# EAGLE design tinyPipes (EAGLE 6.5.0)
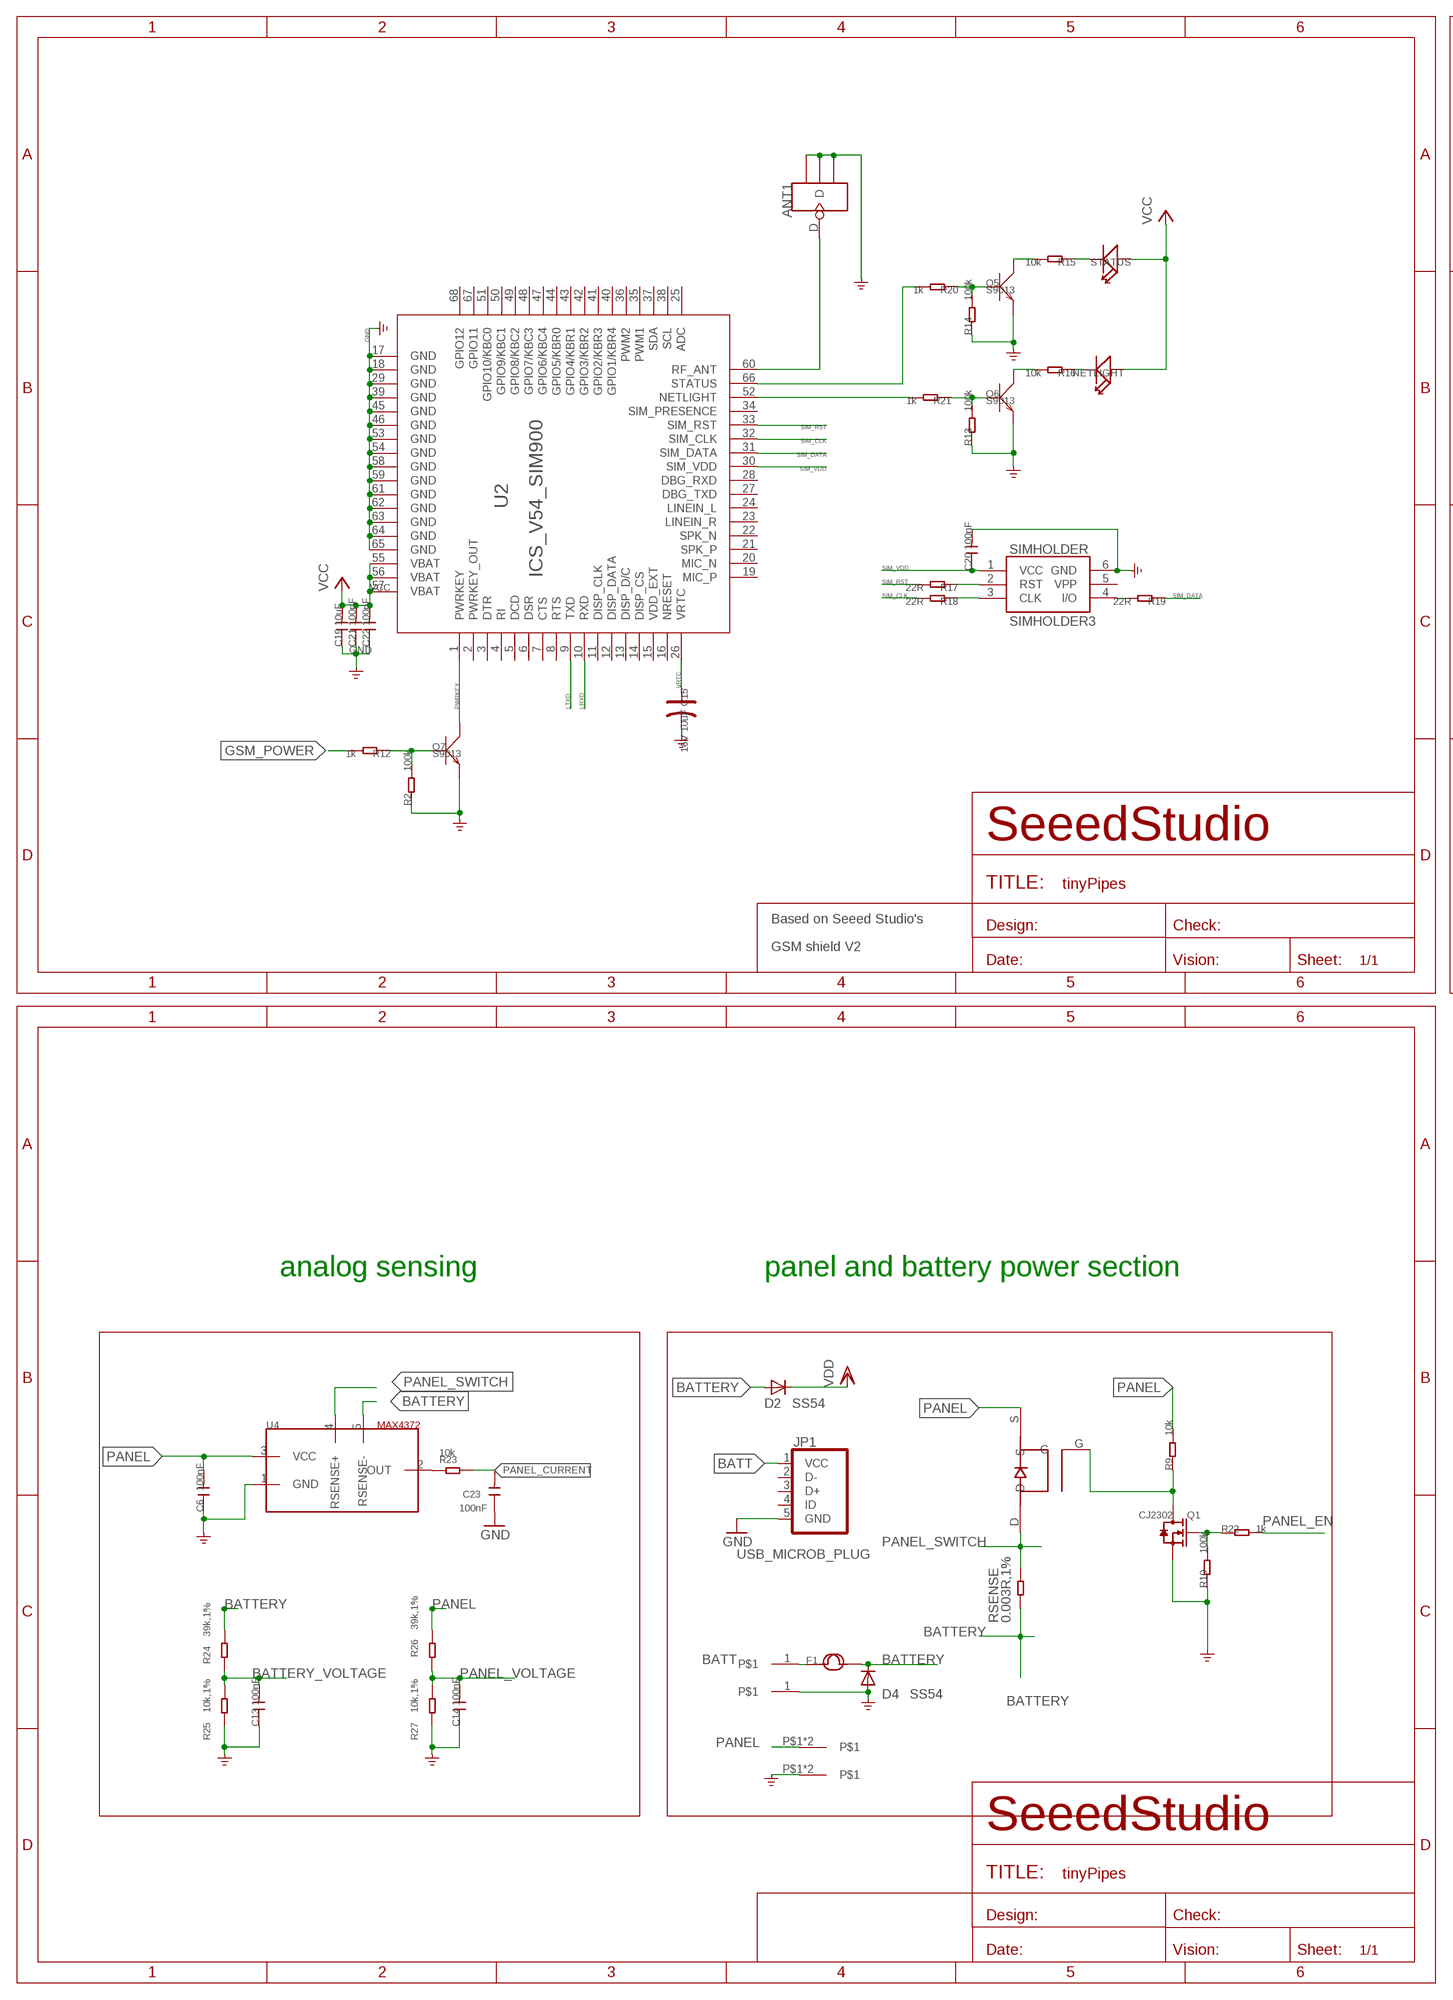
[diagram p0: schematic, sheet 1, part 1 of 2]
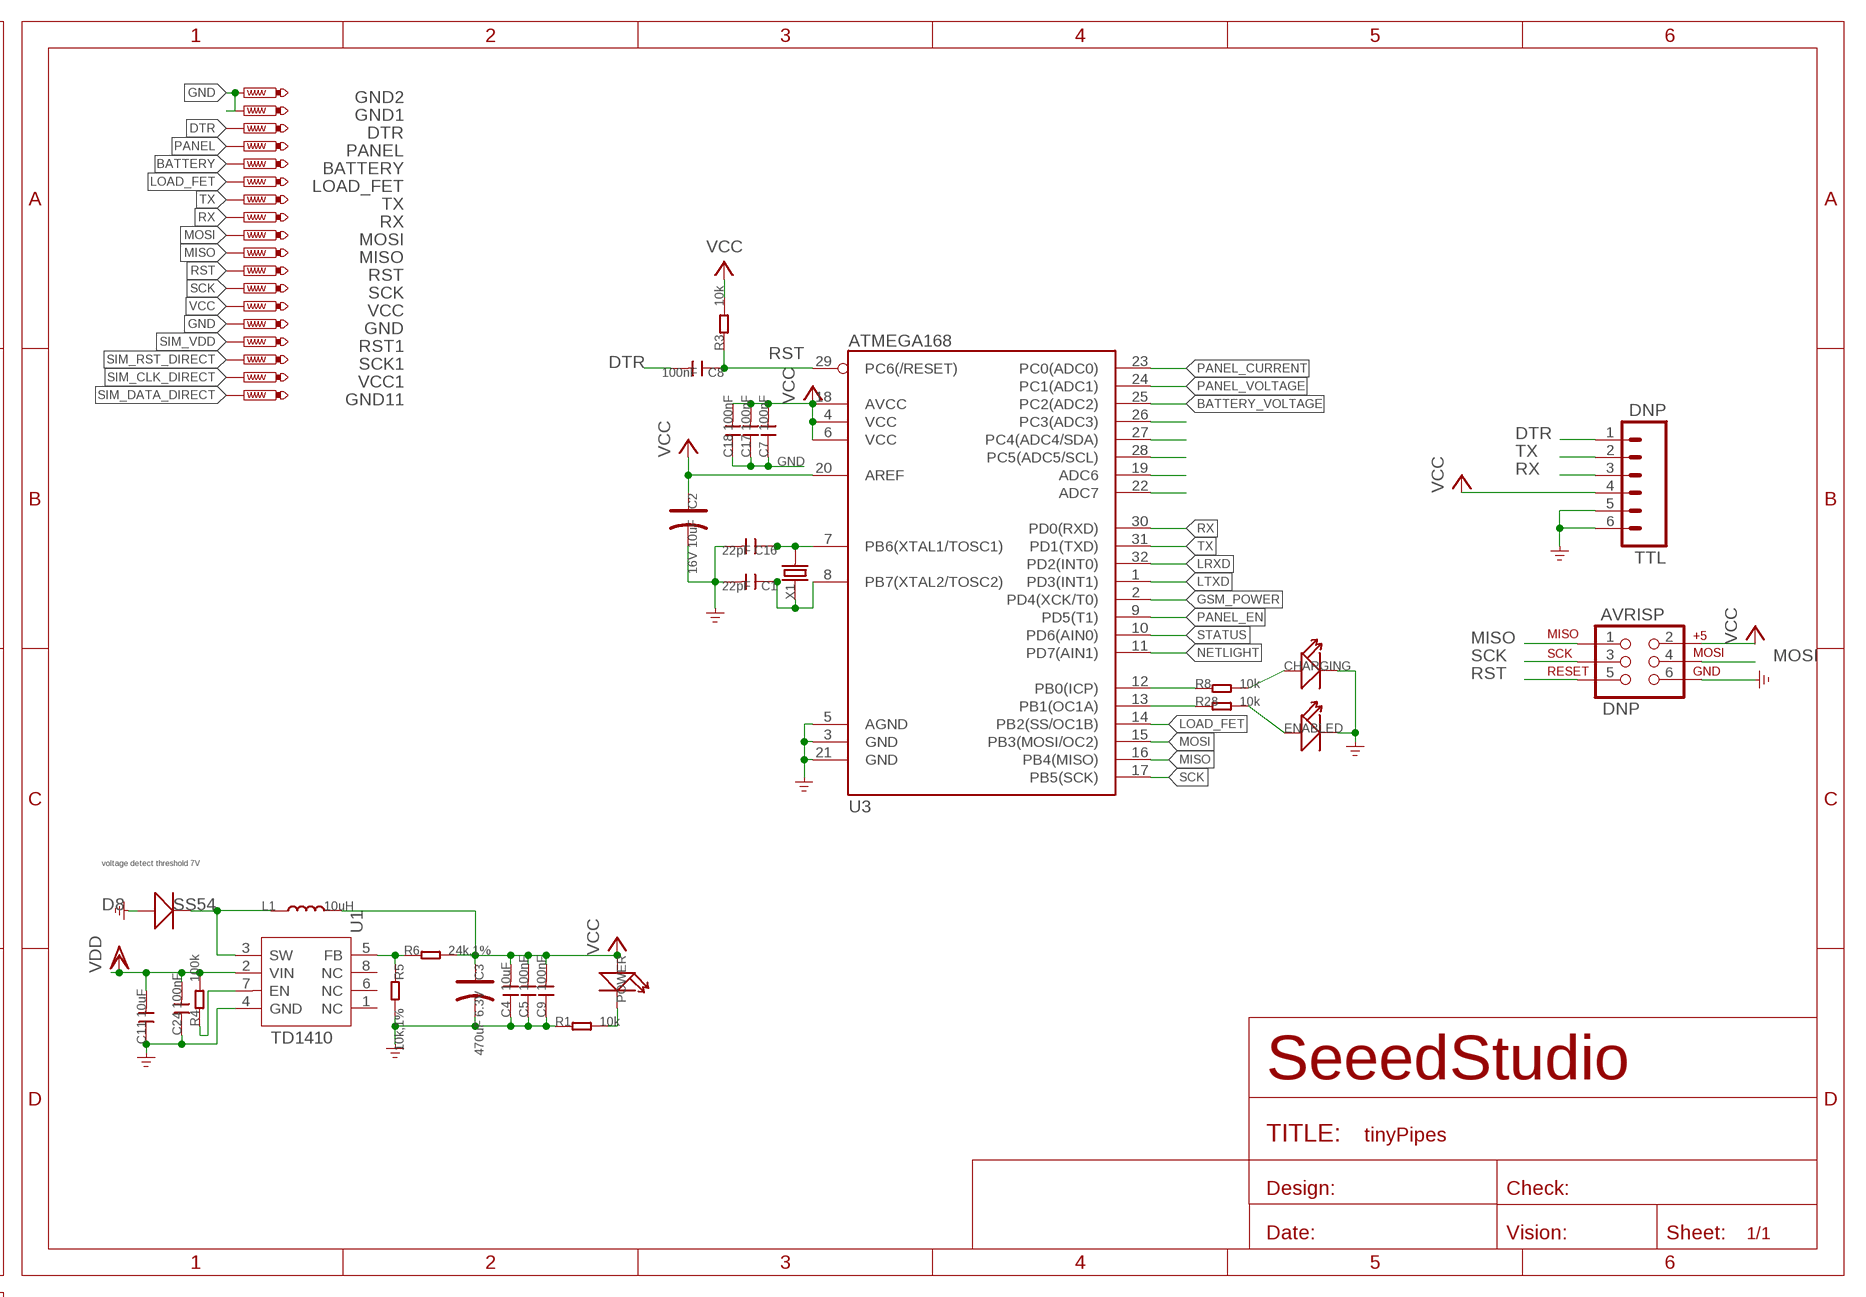
[diagram p1: schematic, sheet 1, part 2 of 2]

## Parts
ANT1  ANTENNA-U-FL  [4P-U-FL]
AVRISP  DNP  AVR_SPI_PRG_62X3_LOCK  [2X3_LOCK]
BATTERY  HEARTPAD  [HEART]
BATTERY+  TINYPIPES_BATTBATT  [TINYPIPES_BATT]
BATTERY-  TINYPIPES_BATTBATT  [TINYPIPES_BATT]
C1  22pF  C-0603  [C0603]
C2  16V 10uF  CAP-AVX-A  [AVX-A]
C3  470uF 6.3V  CAP-AVX-D  [AVX-D]
C4  10uF  C-0805  [C0805]
C5  100nF  C-0603  [C0603]
C6  100nF  C-0603  [C0603]
C7  100nF  C-0603  [C0603]
C8  100nF  C-0603  [C0603]
C9  100nF  C-0603  [C0603]
C11  10uF  C-0805  [C0805]
C13  100nF  C-0603  [C0603]
C14  100nF  C-0603  [C0603]
C15  16V 10uF  CAP-AVX-A  [AVX-A]
C16  22pF  C-0603  [C0603]
C17  100nF  C-0603  [C0603]
C18  100nF  C-0603  [C0603]
C19  10uF  C-0805  [C0805]
C20  100nF  C-0603  [C0603]
C21  100nF  C-0603  [C0603]
C22  100nF  C-0603  [C0603]
C23  100nF  C-0805  [C0805]
C24  100nF  C-0603  [C0603]
CHARGING  LED'0603'  [LED-0603]
D2  SS54  DIODE-SMB  [SMB]
D4  SS54  DIODE-SMB  [SMB]
D8  SS54  D'MBRS240LT3'  [SMB]
DTR  HEARTPAD  [HEART]
ENABLED  LED'0603'  [LED-0603]
F1  FUSE'16R700'  [0210]
GND  HEARTPAD  [HEART]
GND1  HEARTPAD  [HEART]
GND2  HEARTPAD  [HEART]
GND11  HEARTPAD  [HEART]
JP1  USB_MICROB_PLUG  [MICRO-B-RA-SMT]
L1  10uH  L'0630'  [L0630]
LOAD_FET  HEARTPAD  [HEART]
MISO  HEARTPAD  [HEART]
MOSI  HEARTPAD  [HEART]
NETLIGHT  LED'0603'  [LED-0603]
PANEL  HEARTPAD  [HEART]
PANEL+  TINYPIPES_BATTPANEL  [TINYPIPES_PANEL]
PANEL-  TINYPIPES_BATTPANEL  [TINYPIPES_PANEL]
POWER  LED'0603'  [LED-0603]
Q1  CJ2302  MOSFET-N'SOT23'  [SOT23]
Q5  S9013  TRANSISTOR-NPN-SOT23  [SOT23]
Q6  S9013  TRANSISTOR-NPN-SOT23  [SOT23]
Q7  S9013  TRANSISTOR-NPN-SOT23  [SOT23]
R1  10k  R-0603  [R0603]
R2  100k  R-0603  [R0603]
R3  10k  R-0603  [R0603]
R4  100k  R-0603  [R0603]
R5  10k,1%  R-0603  [R0603]
R6  24k,1%  R-0603  [R0603]
R8  10k  R-0603  [R0603]
R9  10k  R-0603  [R0603]
R10  100k  R-0603  [R0603]
R12  1k  R-0603  [R0603]
R13  100k  R-0603  [R0603]
R14  100k  R-0603  [R0603]
R15  10k  R-0603  [R0603]
R16  10k  R-0603  [R0603]
R17  22R  R-0603  [R0603]
R18  22R  R-0603  [R0603]
R19  22R  R-0603  [R0603]
R20  1k  R-0603  [R0603]
R21  1k  R-0603  [R0603]
R22  1k  R-0603  [R0603]
R23  10k  R-0603  [R0603]
R24  39k,1%  R-0603  [R0603]
R25  10k,1%  R-0603  [R0603]
R26  39k,1%  R-0603  [R0603]
R27  10k,1%  R-0603  [R0603]
R28  10k  R-0603  [R0603]
RSENSE  0.003R,1%  R-2512  [R2512]
RST  HEARTPAD  [HEART]
RST1  HEARTPAD  [HEART]
RX  HEARTPAD  [HEART]
SCK  HEARTPAD  [HEART]
SCK1  HEARTPAD  [HEART]
SIMHOLDER  SIMHOLDER3  [SIMHOLDER3]
STATUS  LED'0603'  [LED-0603]
TTL  DNP  M06LOCK  [1X06_LOCK]
TX  HEARTPAD  [HEART]
U1  TD1410  [SOP8]
U2  ICS_V54_SIM900  [ICS_V54_SIM900]
U3  ATMEGA168  [TQFP32-08]
U4  MAX4372  [SOT23-5]
U5  SI4435POWER  [SO8_FET]
VCC  HEARTPAD  [HEART]
VCC1  HEARTPAD  [HEART]
X1  CRYSTAL'5032'  [2P-SMD-5X3.2]

## Nets
`: U3.19(ADC6)
ALT: U3.26(PC3(ADC3))
ALT2: U3.27(PC4(ADC4/SDA))
ALT3: U3.28(PC5(ADC5/SCL))
ALT5: U3.22(ADC7)
BATT [power]: BATTERY+.1 F1.1 JP1.1(VCC)
BATTERY [power]: BATTERY.P$1(TP) D2.A D4.C F1.2 R24.2 RSENSE.1 U4.5(RSENSE-)
BATTERY_VOLTAGE: C13.2 R24.1 R25.2 U3.25(PC2(ADC2))
DTR: C8.2 DTR.P$1(TP) TTL.1
GND: ANT1.GND1 ANT1.GND2 ANT1.GND3 AVRISP.6 BATTERY-.1 C1.2 C2.- C3.- C4.1 C5.1 C6.1 C7.1 C9.1 C11.1 C13.1 C14.1 C15.- C16.2 C17.1 C18.1 C19.1 C20.2 C21.1 C22.1 C23.1 C24.1 CHARGING.- D4.A D8.+ ENABLED.- GND1.P$1(TP) GND2.P$1(TP) GND.P$1(TP) JP1.5(GND) PANEL-.P$1 PANEL-.P$2 Q1.2(S) Q5.2(E) Q6.2(E) Q7.2(E) R1.1 R2.1 R5.2 R10.1 R13.1 R14.1 R25.1 R27.1 SIMHOLDER.6(GND) TTL.5 TTL.6 U1.4(GND) U2.17(GND) U2.18(GND) U2.29(GND) U2.39(GND) U2.45(GND) U2.46(GND) U2.53(GND) U2.54(GND) U2.58(GND) U2.59(GND) U2.61(GND) U2.62(GND) U2.63(GND) U2.64(GND) U2.65(GND) U3.3(GND) U3.5(AGND) U3.21(GND) U4.1(GND)
GSM_POWER: R12.2 U3.2(PD4(XCK/T0))
LOAD_FET: LOAD_FET.P$1(TP) U3.14(PB2(SS/OC1B))
LRXD: U2.10(RXD) U3.32(PD2(INT0))
LTXD: U2.9(TXD) U3.1(PD3(INT1))
MISO: AVRISP.1 MISO.P$1(TP) U3.16(PB4(MISO))
MOSI: AVRISP.4 MOSI.P$1(TP) U3.15(PB3(MOSI/OC2))
N$1: ANT1.D U2.60(RF_ANT)
N$2: C16.1 U3.7(PB6(XTAL1/TOSC1)) X1.2
N$3: Q6.3(C) R16.2
N$4: Q7.1(B) R2.2 R12.1
N$5: Q5.1(B) R14.2 R20.1
N$6: Q6.1(B) R13.2 R21.1
N$7: NETLIGHT.- R16.1
N$8: Q5.3(C) R15.2
N$9: POWER.- R1.2
N$10 [power]: R8.1 U3.12(PB0(ICP))
N$11: Q1.1(G) R10.2 R22.1
N$12: R4.1 U1.7(EN)
N$13: C1.1 U3.8(PB7(XTAL2/TOSC2)) X1.1
N$14 [power]: R28.1 U3.13(PB1(OC1A))
N$15: Q1.3(D) R9.1 U5.G
N$16: R15.1 STATUS.-
N$17: R23.1 U4.2(OUT)
N$18: CHARGING.+ R8.2
N$24: ENABLED.+ R28.2
N$38: D8.- L1.1 U1.3(SW)
N$47: R5.1 R6.1 U1.5(FB)
NETLIGHT: R21.2 U2.52(NETLIGHT) U3.11(PD7(AIN1))
PANEL [power]: C6.2 PANEL+.P$1 PANEL+.P$2 PANEL.P$1(TP) R9.2 R26.2 U4.3(VCC) U5.S
PANEL_CURRENT: C23.2 R23.2 U3.23(PC0(ADC0))
PANEL_EN: R22.2 U3.9(PD5(T1))
PANEL_SWITCH [power]: RSENSE.2 U4.4(RSENSE+) U5.D
PANEL_VOLTAGE: C14.2 R26.1 R27.2 U3.24(PC1(ADC1))
PWRKEY: Q7.3(C) U2.1(PWRKEY)
RST: AVRISP.5 C8.1 R3.1 RST.P$1(TP) U3.29(PC6(/RESET))
RX: RX.P$1(TP) TTL.3 U3.30(PD0(RXD))
SCK: AVRISP.3 SCK.P$1(TP) U3.17(PB5(SCK))
SIM_CLK: R18.2 U2.32(SIM_CLK)
SIM_CLK_DIRECT: R18.1 SIMHOLDER.3(CLK) VCC1.P$1(TP)
SIM_DATA: R19.1 U2.31(SIM_DATA)
SIM_DATA_DIRECT: GND11.P$1(TP) R19.2 SIMHOLDER.4(I/O)
SIM_RST: R17.2 U2.33(SIM_RST)
SIM_RST_DIRECT: R17.1 SCK1.P$1(TP) SIMHOLDER.2(RST)
SIM_VDD: C20.1 RST1.P$1(TP) SIMHOLDER.1(VCC) U2.30(SIM_VDD)
STATUS: R20.2 U2.66(STATUS) U3.10(PD6(AIN0))
TX: TTL.2 TX.P$1(TP) U3.31(PD1(TXD))
VCC: AVRISP.2 C2.+ C3.+ C4.2 C5.2 C7.2 C9.2 C17.2 C18.2 C19.2 C21.2 C22.2 L1.2 NETLIGHT.+ POWER.+ R3.2 R6.2 STATUS.+ TTL.4 U2.55(VBAT) U2.56(VBAT) U2.57(VBAT) U3.4(VCC) U3.6(VCC) U3.18(AVCC) U3.20(AREF) VCC.P$1(TP)
VDD: C11.2 C24.2 D2.C R4.2 U1.2(VIN)
VRTC: C15.+ U2.26(VRTC)
Unconnected: JP1.2(D-) JP1.3(D+) JP1.4(ID) SIMHOLDER.5(VPP) U1.1(NC) U1.6(NC) U1.8(NC) U2.2(PWRKEY_OUT) U2.3(DTR) U2.4(RI) U2.5(DCD) U2.6(DSR) U2.7(CTS) U2.8(RTS) U2.11(DISP_CLK) U2.12(DISP_DATA) U2.13(DISP_D/C) U2.14(DISP_CS) U2.15(VDD_EXT) U2.16(NRESET) U2.19(MIC_P) U2.20(MIC_N) U2.21(SPK_P) U2.22(SPK_N) U2.23(LINEIN_R) U2.24(LINEIN_L) U2.25(ADC) U2.27(DBG_TXD) U2.28(DBG_RXD) U2.34(SIM_PRESENCE) U2.35(PWM1) U2.36(PWM2) U2.37(SDA) U2.38(SCL) U2.40(GPIO1/KBR4) U2.41(GPIO2/KBR3) U2.42(GPIO3/KBR2) U2.43(GPIO4/KBR1) U2.44(GPIO5/KBR0) U2.47(GPIO6/KBC4) U2.48(GPIO7/KBC3) U2.49(GPIO8/KBC2) U2.50(GPIO9/KBC1) U2.51(GPIO10/KBC0) U2.67(GPIO11) U2.68(GPIO12)

## Notes on the sheet
- voltage detect threshold 7V
- Based on Seeed Studio's
- GSM shield V2
- analog sensing | panel and battery power section

## Library data of the parts
ANT1 = Connector:ANTENNA-U-FL
AVRISP = SparkFun:AVR_SPI_PRG_6: AVR ISP 6 Pin This is the reduced ISP connector for AVR programming. Common on Arduino. This footprint will take up less PCB space and can be used with a 10-pin to 6-pin adapter such as SKU: BOB-08508
BATTERY DTR GND GND1 GND2 GND11 LOAD_FET MISO MOSI PANEL RST RST1 RX SCK SCK1 TX VCC VCC1 = heart:HEARTPAD
BATTERY+ BATTERY- PANEL+ PANEL- = tinyPipes_v2.5:TINYPIPES_BATT
C1 C4-C9 C11 C13 C14 C16-C24 = Discrete:C*: Ceramic Capacitors
C2 C3 C15 = Discrete:CAP*: Electrolytic Capacitors,Tantalum Capacitors and Super Capacitors
CHARGING ENABLED NETLIGHT POWER STATUS = Discrete:LED*
D2 D4 = diode:DIODE-: DIODE
D8 = Discrete:D*
F1 = template:FUSE
JP1 = SparkFun-Connectors:USB_MICROB_PLUG: USB Micro-B Plug Comes in a variety of packages. Check out Hirose's ZX-x0 line: http://www.hirose.co.jp/cataloge_hp/e24200011.pdf
L1 = Discrete:L*
Q1 = Discrete:MOSFET-N: IRLL014: http://www.vishay.com/docs/91319/sihll014.pdf
Q5-Q7 = Discrete:TRANSISTOR-NPN*: NPN audion
R1-R6 R8-R10 R12-R28 RSENSE = Discrete:R*
SIMHOLDER = SparkFun2:SIMHOLDER3
TTL = SparkFun-Connectors:M06: Header 6 Standard 6-pin 0.1" header. Use with straight break away headers (SKU : PRT-00116), right angle break away headers (PRT-00553), swiss pins (PRT-00743), machine pins (PRT-00117), and female headers (PRT-00115). Molex polarized connector foot print use with SKU : PRT-08094 with associated crimp pins and housings. NOTES ON THE VARIANTS LOCK and LOCK_LONGPADS... This footprint was designed to help hold the alignment of a through-hole component (i.e. 6-pin header) while soldering it into place. You may notice that each hole has been shifted either up or down by 0.005 of an inch from it's more standard position (which is a perfectly straight line). This slight alteration caused the pins (the squares in the middle) to touch the edges of the holes. Because they are alternating, it causes a "brace" to hold the component in place. 0.005 has proven to be the perfect amount of "off-center" position when using our standard breakaway headers. Although looks a little odd when you look at the bare footprint, once you have a header in there, the alteration is very hard to notice. Also,if you push a header all the way into place, it is covered up entirely on the bottom side. This idea of altering the position of holes to aid alignment will be further integrated into the Sparkfun Library for other footprints. It can help hold any component with 3 or more connection pins.
U1 = template:TD1410: 2A 380KHz 20V PWM Buck DC/DC Converter
U2 = tinyPipes v2.2:ICS_V54_SIM900
U3 = SparkFun:ATMEGA168
U4 = tinyPipes:MAX4372
U5 = tinyPipes:SI4435
X1 = Discrete:CRYSTAL*: CRYSTAL

## Board
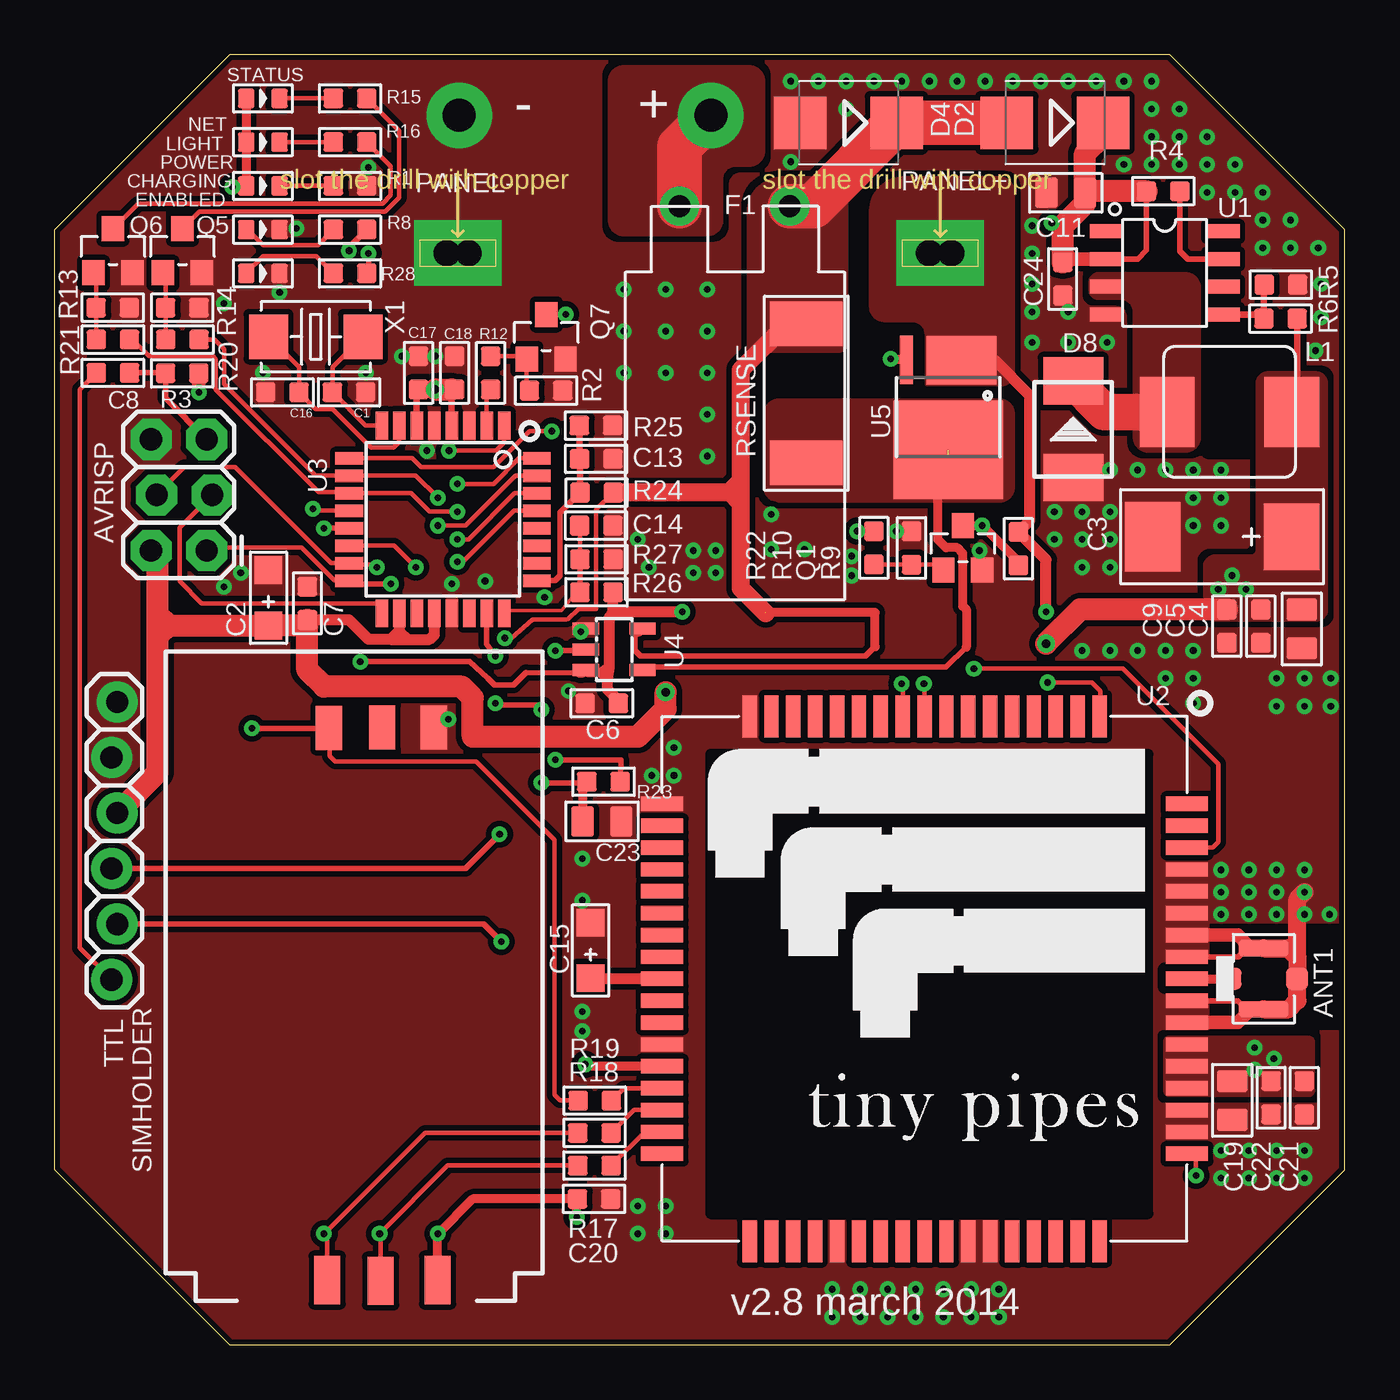
[diagram p2: board, top side]
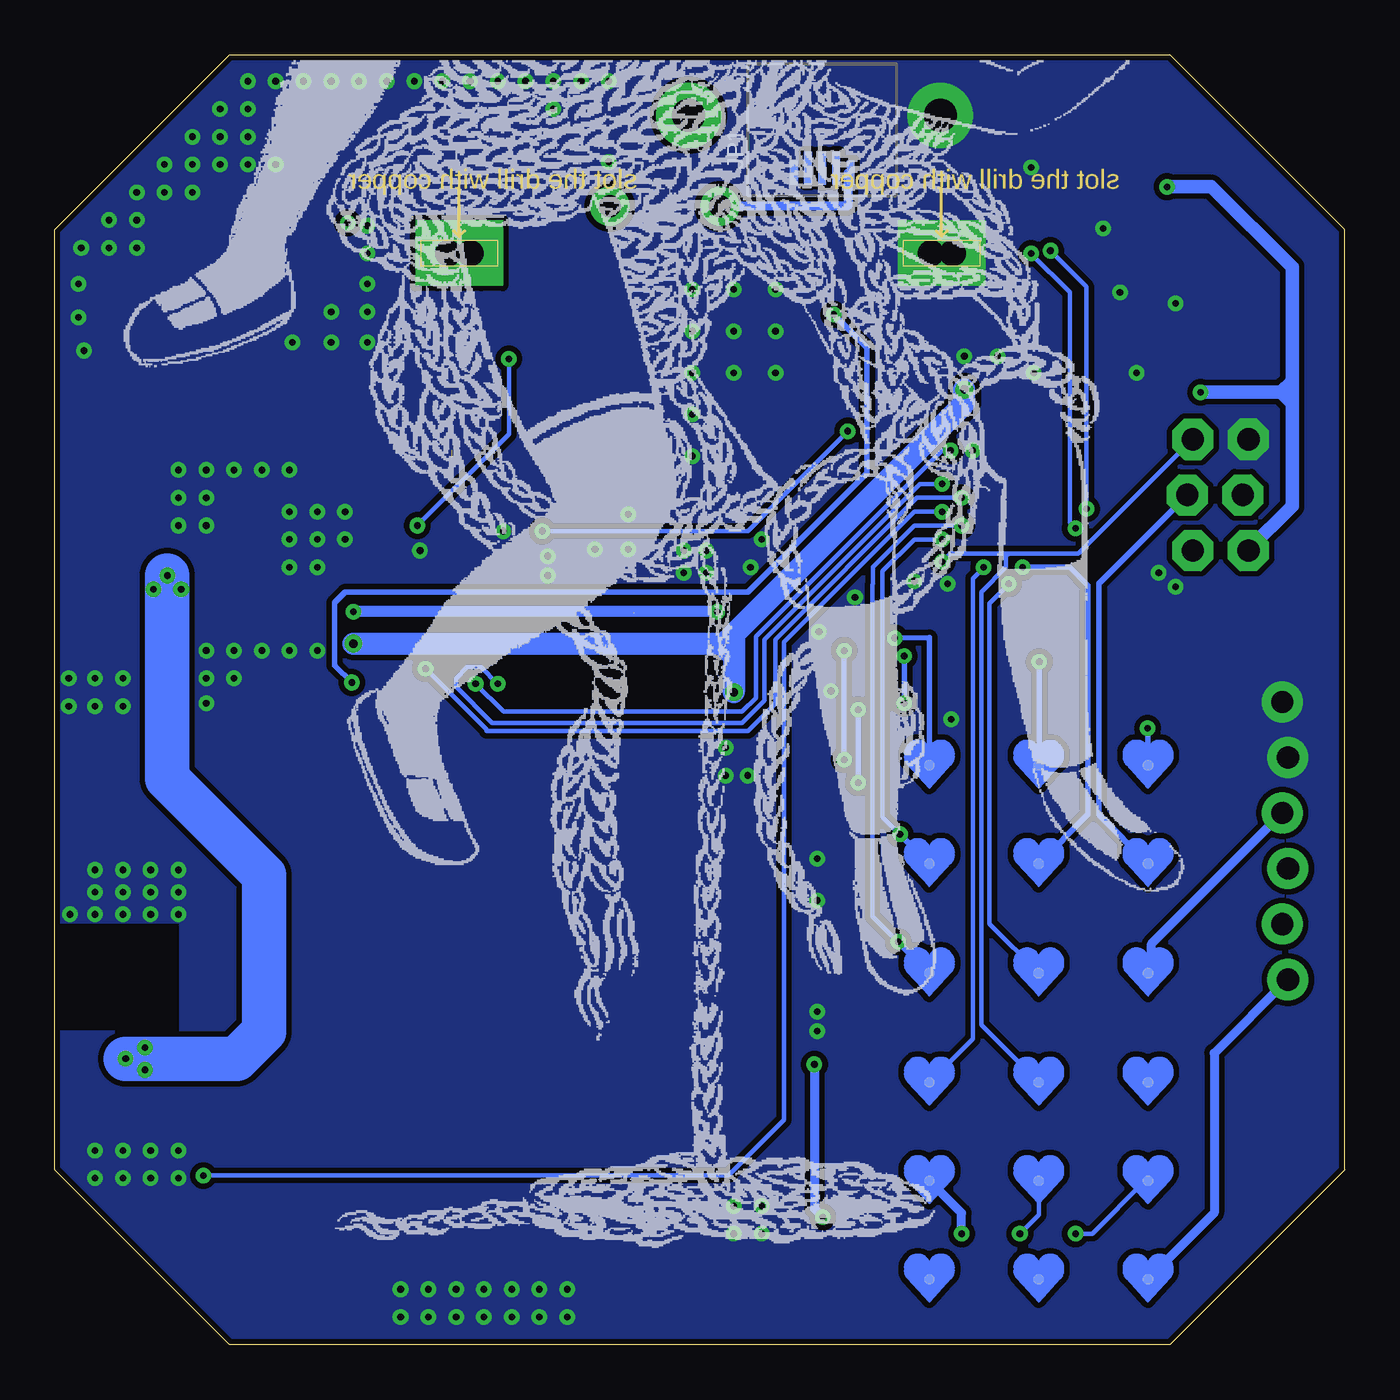
[diagram p3: board, bottom side, seen from below]

Size 59 x 59 mm. Coordinates in mm from the lower left corner, seen from the top.
Outline: 8,0 51,0 59,8 59,51 51,59 8,59 0,51 0,8 8,0
Copper layers (1*16): Top 0.035mm / dielectric 1.5mm / Bottom 0.035mm
Design rules "default *": minimum track width 6mil, minimum drill 12mil, track to track 6mil, track to pad 6mil, pad to pad 6mil, via to via 6mil, smd to smd 0mil, copper to edge 10mil, drill to drill 8mil, minimum pad ring 10mil, minimum via ring 8mil, stop-mask expansion 4mil, vias tented up to drill 0.7mm, thermal gap 10mil
tRestrict: area 30,6 to 50,27; area 52.7,40.8 to 54.6,44.6; 8 lines

### Footprints (pad centres in the part's own frame; a part is rotated, then mirrored left to right if it is on the bottom)
4P-U-FL = smd 1.016 x 1.016: D -1.524,0; GND3 1.524,0 | smd 2.286 x 0.762: GND1 0,1.397; GND2 0,-1.397
2X3_LOCK = drill 1.016 pad 1.88 octagon: 1 0,0; 2 0,2.54; 3 2.54,-0.254; 4 2.54,2.286; 5 5.08,0; 6 5.08,2.54
HEART = smd 0.5 x 0.5: P$1 0,0
TINYPIPES_BATT = drill 1.5 pad 3: 1 0,0
C0603 = smd 0.889 x 0.889: 1 -0.762,0; 2 0.762,0
AVX-A = smd 1.27 x 1.27: + -1.27,0; - 1.27,0
AVX-D = smd 2.54 x 3.048: + -3.175,0 | smd 2.54 x 3.175: - 3.175,0
C0805 = smd 1.016 x 1.397: 1 -0.889,0; 2 0.889,0
LED-0603 = smd 0.762 x 0.889: + -0.762,0; - 0.762,0
SMB = smd 2.4 x 2.4: A 2.2,0; C -2.2,0
SMB' = smd 2.159 x 2.743: + -2.21,0; - 2.21,0
0210 = drill 1 pad 1.8: 1 -2.54,0; 2 2.5,0
MICRO-B-RA-SMT = smd 0.35 x 1.1: 1 1.3,-1.95; 5 -1.3,-1.95 | smd 0.35 x 1.5: 2 0.65,-1.75; 3 0,-1.75; 4 -0.65,-1.75
L0630 = smd 2.5 x 3.2: 1 -2.85,0; 2 2.85,0
TINYPIPES_PANEL = drill 1.2 pad 3 square: P$1 -0.492,0; P$2 0.508,0
SOT23 = smd 1.016 x 1.143: 1 -0.889,-1.016; 2 0.889,-1.016; 3 0,1.016
R0603 = smd 0.889 x 0.889: 1 -0.762,0; 2 0.762,0
R2512 = smd 2.032 x 3.302: 1 -3.175,0; 2 3.175,0
SIMHOLDER3 = smd 2.2 x 1.2: 1 0.95,4.81; 2 0.91,7.41; 3 0.95,9.86 | smd 2 x 1.2: 4 26.2,9.78; 5 26.22,7.34; 6 26.22,4.98
1X06_LOCK = drill 1.016 pad 1.88: 1 0,0; 2 2.54,-0.254; 3 5.08,0; 4 7.62,-0.254; 5 10.16,0; 6 12.7,-0.254
SOP8 = smd 0.635 x 1.524: 1 -1.905,-2.667; 2 -0.635,-2.667; 3 0.635,-2.667; 4 1.905,-2.667; 5 1.905,2.667; 6 0.635,2.667; 7 -0.635,2.667; 8 -1.905,2.667
ICS_V54_SIM900 = smd 1.93 x 0.66: 1 -12,8; 2 -12,7; 3 -12,6; 4 -12,5; 5 -12,4; 6 -12,3; 7 -12,2; 8 -12,1; 9 -12,0; 10 -12,-1; 11 -12,-2; 12 -12,-3; 13 -12,-4; 14 -12,-5; 15 -12,-6; 16 -12,-7; 17 -12,-8; 35 12,-8; 36 12,-7; 37 12,-6; 38 12,-5; 39 12,-4; 40 12,-3; 41 12,-2; 42 12,-1; 43 12,0; 44 12,1; 45 12,2; 46 12,3; 47 12,4; 48 12,5; 49 12,6; 50 12,7; 51 12,8 | smd 0.66 x 1.93: 18 -8,-12; 19 -7,-12; 20 -6,-12; 21 -5,-12; 22 -4,-12; 23 -3,-12; 24 -2,-12; 25 -1,-12; 26 0,-12; 27 1,-12; 28 2,-12; 29 3,-12; 30 4,-12; 31 5,-12; 32 6,-12; 33 7,-12; 34 8,-12; 52 8,12; 53 7,12; 54 6,12; 55 5,12; 56 4,12; 57 3,12; 58 2,12; 59 1,12; 60 0,12; 61 -1,12; 62 -2,12; 63 -3,12; 64 -4,12; 65 -5,12; 66 -6,12; 67 -7,12; 68 -8,12
TQFP32-08 = smd 1.27 x 0.559: 1 -4.293,2.8; 2 -4.293,2; 3 -4.293,1.2; 4 -4.293,0.4; 5 -4.293,-0.4; 6 -4.293,-1.2; 7 -4.293,-2; 8 -4.293,-2.8; 17 4.293,-2.8; 18 4.293,-2; 19 4.293,-1.2; 20 4.293,-0.4; 21 4.293,0.4; 22 4.293,1.2; 23 4.293,2; 24 4.293,2.8 | smd 0.559 x 1.27: 9 -2.8,-4.293; 10 -2,-4.293; 11 -1.2,-4.293; 12 -0.4,-4.293; 13 0.4,-4.293; 14 1.2,-4.293; 15 2,-4.293; 16 2.8,-4.293; 25 2.8,4.293; 26 2,4.293; 27 1.2,4.293; 28 0.4,4.293; 29 -0.4,4.293; 30 -1.2,4.293; 31 -2,4.293; 32 -2.8,4.293
SOT23-5 = smd 0.55 x 1.2: 1 -0.95,-1.3; 2 0,-1.3; 3 0.95,-1.3; 4 0.95,1.3; 5 -0.95,1.3
SO8_FET = smd 5 x 4.5: D 0,1.5 | smd 0.61 x 2.21: G 1.905,-2.616 | smd 3.2 x 2.2: S -0.6,-2.6
2P-SMD-5X3.2 = smd 1.778 x 2.032: 1 -2.159,0; 2 2.159,0

### Placement (x,y rotation side)
ANT1  55.29,16.74 0 top
AVRISP  6.95,36.33 90 top
BATTERY  19,26.5 0 bottom
BATTERY+  30.01,56.23 180 top
BATTERY-  18.5,56.23 180 top
C1  13.46,43.56 0 top
C2  9.78,34.16 90 top
C3  53.39,36.95 180 top
C4  57.03,32.74 90 top
C5  55.16,32.86 90 top
C6  25.02,29.34 0 top
C7  11.56,33.91 270 top
C8  2.67,44.45 180 top
C9  53.6,32.86 90 top
C11  46.24,52.68 0 top
C13  24.77,40.51 180 top
C14  24.77,37.47 180 top
C15  24.51,18.03 90 top
C16  10.41,43.56 180 top
C17  16.64,44.45 270 top
C18  18.29,44.45 270 top
C19  53.85,11.18 90 top
C20  24.67,6.67 0 top
C21  57.15,11.3 90 top
C22  55.63,11.3 90 top
C23  25.03,23.94 180 top
C24  46.1,48.74 90 top
CHARGING  9.53,51 0 top
D2  45.74,55.89 180 top
D4  36.3,55.88 180 top
D8  SS54  [SMB']  46.58,41.88 90 top
DTR  9,3 0 bottom
ENABLED  9.53,49 0 top
F1  31.11,52.07 0 top
GND  9,12 0 bottom
GND1  14,3 0 bottom
GND2  19,3 0 bottom
GND11  9,26.5 0 bottom
JP1  23.9,55.55 0 bottom
L1  53.73,42.67 0 top
LOAD_FET  19,12 0 bottom
MISO  14,17 0 bottom
MOSI  14,22 0 bottom
NETLIGHT  9.53,55 0 top
PANEL  14,26.5 0 bottom
PANEL+  40.5,49.93 180 top
PANEL-  18.44,49.93 180 top
POWER  9.53,53 0 top
Q1  41.53,36.45 0 top
Q5  5.84,50.04 0 top
Q6  2.67,50.04 0 top
Q7  22.48,46.1 0 top
R1  13.51,53 180 top
R2  22.48,43.64 180 top
R3  5.83,44.43 0 top
R4  50.69,52.76 180 top
R5  56.08,48.48 0 top
R6  56.06,46.93 0 top
R8  13.51,51 180 top
R9  44.07,36.41 90 top
R10  39.19,36.44 270 top
R12  19.94,44.45 270 top
R13  2.65,47.43 180 top
R14  5.84,47.43 180 top
R15  13.51,57 0 top
R16  13.51,55 0 top
R17  24.68,8.2 0 top
R18  24.68,9.69 0 top
R19  24.7,11.17 180 top
R20  5.84,45.97 0 top
R21  2.67,45.97 0 top
R22  37.47,36.45 90 top
R23  25.1,25.75 180 top
R24  24.79,38.97 0 top
R25  24.75,42.04 180 top
R26  24.78,34.41 0 top
R27  24.78,35.92 180 top
R28  13.51,49 180 top
RSENSE  34.37,43.51 270 top
RST  14,12 0 bottom
RST1  19,7.5 0 bottom
RX  19,22 0 bottom
SCK  9,22 0 bottom
SCK1  14,7.5 0 bottom
SIMHOLDER  22.32,2.01 90 top
STATUS  9.53,57 0 top
TTL  2.6,16.7 90 top
TX  19,17 0 bottom
U1  50.76,49.02 270 top
U2  39.78,16.74 270 top
U3  17.76,37.74 270 top
U4  25.59,31.8 270 top
U5  40.86,42.42 180 top
VCC  9,17 0 bottom
VCC1  9,7.5 0 bottom
X1  11.94,46.1 180 top

### Tracks (layer width: path | path; a pad name or v marks a point on that pad's centre or on a via)
BATT
  Top 2.032: F1.1 28.57,54.79 BATTERY+.1
  Bottom 0.152: 22.7,53.6 JP1.1 | 28.5,52.1 F1.1
  Bottom 0.406: 22.7,53.6 22.7,52.1 28.5,52.1
  pour Top (isolate 0.254, no thermals): 26.04,58.42 31.75,58.42 arc-90 32.38,57.78 32.38,54.61 arc-90 31.75,53.98 31.11,53.98 arc90 30.48,53.34 30.48,51.44 arc-90 29.84,50.8 26.04,50.8 arc-90 25.4,51.44 25.4,57.78 arc-90
BATTERY  (via drill 0.3 pad 0.64)  (1 unrouted)
  Top 0.203: v20.58,32.32 20.9,32.32 21.84,33.17 23.38,33.17 23.48,33.18 23.95,33.65 24.77,33.66 24.77,38.19 R24.2
  Top 0.254: 37.52,31.93 37.08,31.5 26.8,31.5 26.54,31.75 26.54,32.6
  Top 0.4: 26.54,32.6 26.73,32.6 U4.5 | 37.52,31.93 37.52,33.48 37.5,33.5 32.5,33.5
  Top 0.813: R24.2 25.57,38.99 30.86,38.99 | 33.48,46.69 31.37,44.58 31.37,39.5 | 31.37,39.5 31.37,38.48 | 31.37,38.48 31.37,34.6 32.51,33.46 | 30.86,38.99 31.37,39.5 | 30.86,38.99 31.37,38.48
  Top 2.032: F1.2 34.69,52.07 D4.C D2.A 43.49,55.94
  Bottom 0.254: BATTERY.P$1 19,32.34 v20.58,32.32
  pour Top (isolate 0.254, no thermals): 31.75,45.47 31.75,51.81 arc-90 33.28,53.34 36.2,53.34 36.2,45.83 arc-90 35.84,45.47
BATTERY_VOLTAGE
  Top 0.254: U3.25 22.88,34.94 23.11,35.18 23.11,38.06 R24.1
  Top 0.305: R24.1 24.03,40.49 C13.2 24,42.03 R25.2
DTR
  Top 0.203: TTL.1 1.14,18.16 1.14,43.69 C8.2
  Bottom 0.406: TTL.1 5.97,13.34 5.97,6.03 DTR.P$1
GND  (via drill 0.3, 0.3 pad 0.64)
  Top 0.254: U2.59 54.11,15.74 54.61,15.24 | U2.61 54.13,17.74 54.52,18.14
  Top 0.406: 54.61,15.24 55.19,15.24 ANT1.GND2
  Top 0.61: Q1.2 42.42,35.18 | U2.58 54.11,14.74 54.61,15.24 | U2.62 54.09,18.74 54.55,18.29 54.55,18.16 54.52,18.14 ANT1.GND1
  Top 0.813: ANT1.GND1 56.42,18.14 56.83,17.72 | 56.83,17.72 56.83,16.72 | ANT1.GND2 56.43,15.34 56.83,15.75 56.83,16.72 | 56.83,16.72 ANT1.GND3 | 56.83,17.72 56.83,20.38 v57.15,20.7
  other vias: 22.4,34.19 17.4,45.21 17.02,40.89 33.66,57.78 34.92,57.78 36.2,57.78 36.2,56.52 33.66,54.1 37.47,57.78 38.73,57.78 40.01,57.78 41.27,57.78 42.55,57.78 43.81,57.78 45.09,57.78 46.35,57.78 47.62,57.78 48.9,57.78 50.16,57.78 51.44,56.52 50.16,56.52 50.16,55.24 51.44,55.24 52.7,55.24 50.16,53.98 51.44,53.98 48.9,53.98 52.7,53.98 52.7,52.7 53.98,52.7 53.98,53.98 55.24,52.7 55.24,51.44 55.24,50.16 56.52,50.16 56.52,51.44 44.7,51.18 44.7,49.91 44.7,48.51 44.7,47.24 44.7,45.85 46.35,45.85 46.35,47.24 48.13,45.85 45.72,38.1 46.99,38.1 48.26,38.1 48.26,36.83 46.99,36.83 45.72,36.83 46.99,35.56 48.26,35.56 52.07,31.75 55.88,30.48 57.15,30.48 57.15,29.21 55.88,29.21 52.07,29.34 52.07,30.48 48.26,40.01 49.53,40.01 52.07,38.73 53.34,38.73 52.07,40.01 53.34,40.01 50.8,40.01 52.07,37.47 53.34,37.47 57.91,48.51 57.78,50.16 57.91,46.99 57.66,45.47 24.13,20.32 53.34,19.68 54.61,19.68 55.88,19.68 57.15,19.68 58.29,19.68 27.18,35.56 26.67,36.83 9.53,44.45 14.22,44.45 7.75,47.62 10.29,48.13 11.05,51.05 19.68,34.92 53.34,8.89 54.61,8.89 55.88,8.89 57.15,8.89 57.15,7.62 55.88,7.62 54.61,7.62 53.34,7.62 14.35,53.85 53.34,21.72 53.34,20.7 54.61,20.7 54.61,21.72 55.88,21.72 55.88,20.7 57.15,21.72 35.56,2.54 36.83,2.54 38.1,2.54 39.37,2.54 40.64,2.54 41.91,2.54 43.18,2.54 27.3,26.04 28.32,26.04 28.32,27.3 24.13,15.24 38.48,37.21 36.45,36.07 36.45,35.18 34.29,36.39 32.77,37.97 18.16,34.8 24.13,22.23 8.51,35.31 7.75,34.67 35.56,1.27 36.83,1.27 38.1,1.27 39.37,1.27 40.64,1.27 41.91,1.27 43.18,1.27 42.29,36.32 46.99,31.75 48.26,31.75 50.8,31.75 50.8,30.48 49.53,31.75 58.36,30.48 58.36,29.21 32.77,36.39 27.94,48.26 29.84,48.26 26.04,48.26 27.94,46.35 29.84,46.35 27.94,44.45 29.84,44.45 29.84,42.55 29.84,40.64 30.23,36.32 24.13,14.35 26.67,6.35 27.94,6.35 26.67,5.08 27.94,5.08 26.04,44.45 26.04,46.35 15.88,45.21 29.21,36.32 30.23,35.31 29.21,35.31 18,28.6 23.5,29.9 24.05,32.6
  pour Top (isolate 0.254, rank 6, no thermals): 0,59.05 59.05,59.05 59.05,19.37 52.7,19.37 52.7,14.29 59.05,14.29 59.05,0 0,0
  pour Bottom (isolate 0.254, rank 6, no thermals): 0,59.05 59.05,59.05 59.05,19.37 53.21,19.37 53.21,14.29 59.05,14.29 59.05,0 0,0
GSM_POWER
  Top 0.203: U3.2 19.76,43.51 R12.2
LOAD_FET  (via drill 0.3 pad 0.64)
  Top 0.203: U3.14 15.53,36.54 v16.51,35.56
  Bottom 0.203: v16.51,35.56 17.02,35.05 17.02,13.98 LOAD_FET.P$1
LRXD  (via drill 0.3 pad 0.64)
  Top 0.203: U3.32 21.24,40.54 20.07,39.37 v18.41,39.37 | U2.10 38.78,30.18 v38.73,30.23
  Bottom 0.203: v38.73,30.23 39.5,30.99 40.13,30.99 40.64,30.48 40.64,30.1 38.99,28.45 27.56,28.45 26.54,29.46 26.54,32.26 19.43,39.37 v18.41,39.37
LTXD  (via drill 0.3 pad 0.64)
  Top 0.203: 20.7,42.29 20.56,42.15 U3.1 20.56,41.26 20.19,40.89 v18.03,40.89 | U2.9 39.78,30.2 v39.75,30.23
  Bottom 0.203: v39.75,30.23 38.48,28.96 27.56,28.96 26.92,29.59 26.92,32.38 18.41,40.89 v18.03,40.89
MISO  (via drill 0.3 pad 0.64)
  Top 0.203: U3.16 12.81,34.94 11.3,36.45 7.07,36.45 AVRISP.1
  Top 0.254: U3.16 13.82,34.94 13.97,34.8 v15.37,34.8
  Bottom 0.203: v15.37,34.8 16.26,33.91 16.26,19.26 MISO.P$1
  Bottom 0.254: MISO.P$1 14,17.18
MOSI  (via drill 0.3 pad 0.64)
  Top 0.203: AVRISP.4 5.92,40.13 8.26,40.13 12.64,35.74 U3.15 | 13.52,35.69 14.61,35.69 v14.73,35.56
  Top 0.254: 13.52,35.69 U3.15
  Bottom 0.254: 13.94,22 MOSI.P$1 11.74,24.26 11.74,34.73 12.57,35.56 v14.73,35.56
N$1
  Top 0.406: U2.60 ANT1.D
N$2
  Top 0.203: U3.7 15.76,41.28 15.49,41.02 14.48,41.02 12.7,42.8 11.94,42.8 C16.1 11.18,44.7 X1.2
N$3
  Top 0.203: Q6.3 3.81,52.2 14.99,52.2 15.37,52.58 15.37,53.9 R16.2
N$4
  Top 0.203: R12.1 21.46,45.21 Q7.1 21.59,43.76 R2.2
N$5
  Top 0.203: R20.1 R14.2 5.07,48.9 Q5.1
N$6
  Top 0.203: R21.1 1.91,47.41 R13.2 1.89,48.91 Q6.1
N$7
  Top 0.203: NETLIGHT.- R16.1
N$8
  Top 0.203: Q5.3 6.6,51.82 15.11,51.82 15.75,52.45 15.75,55.52 R15.2
N$9
  Top 0.203: POWER.- R1.2
N$10  (via drill 0.3 pad 0.64)
  Top 0.203: U3.12 11.89,38.14 v11.81,38.23 | 14.22,51.05 R8.1
  Top 0.254: v13.46,50.04 13.46,50.19 R8.1
  Bottom 0.203: v11.81,38.23 11.81,48.39 v13.46,50.04
N$11
  Top 0.203: R22.1 39.18,35.69 R10.2 40.39,35.68 Q1.1
N$12
  Top 0.254: R4.1 51.46,50.02 51.82,49.66 U1.7
N$13
  Top 0.203: U3.8 14.22,42.04 C1.1 12.7,44.7 X1.1
N$14  (via drill 0.3 pad 0.64)
  Top 0.203: 14.22,49.05 R28.1
  Top 0.254: v14.35,49.91 14.35,49.08 R28.1 | U3.13 v12.32,37.34
  Bottom 0.203: v12.32,37.34 12.57,37.59 12.57,48.13 v14.35,49.91
N$15  (via drill 0.3 pad 0.64)
  Top 0.406: Q1.3 v42.42,37.47 44.07,35.81 R9.1 | v38.23,45.09 38.9,45.09 U5.G
  Bottom 0.203: v38.23,45.09 38.23,41.66 v42.42,37.47
N$16
  Top 0.203: STATUS.- R15.1
N$17  (via drill 0.3 pad 0.1)
  Top 0.254: R23.1 25.9,26.6 25.9,26.75 v22.9,26.75 | v22.9,31.75 24.29,31.75 U4.2
  Bottom 0.254: v22.9,26.75 v22.9,31.75
N$18
  Top 0.203: CHARGING.+ 8.82,51 9.53,50.29 12.04,50.29 R8.2
N$24
  Top 0.203: ENABLED.+ 8.76,49.02 9.53,49.78 11.96,49.78 R28.2
N$38
  Top 1.676: L1.1 48,42.67 D8.-
  pour Top (isolate 0.254, no thermals): 51.69,40.89 50.04,40.89 arc-90 49.4,41.53 49.4,47.24 arc90 48.77,47.88 47.75,47.88 arc-90 47.37,48.26 47.37,48.58 arc-90 47.75,48.96 51.69,48.96 arc-90 52.32,48.32 52.32,41.53 arc-90
N$47
  Top 0.305: U1.5 55.11,47.12 R6.1 55.3,48.46 R5.1
NETLIGHT  (via drill 0.3 pad 0.64)
  Top 0.203: R21.2 3.56,45.97 4.32,45.21 7.24,45.21 7.37,45.09 7.37,43.69 12.06,38.99 13.42,38.99 U3.11 16.3,38.94 17.14,38.1 v18.41,38.1 | v52.2,7.75 52.2,8.64 52.07,8.76 51.8,8.76 U2.52
  Bottom 0.203: v52.2,7.75 28.19,7.75 25.65,10.29 25.65,32.13 19.68,38.1 v18.41,38.1
PANEL  (via drill 0.3 pad 0.64)
  Top 0.254: v13.97,31.24 18.98,31.24 19.8,30.5 20.12,30.18 20.98,30.18 21.55,30.75 23.96,30.73
  Top 0.4: 23.96,30.73 24.17,30.73 U4.3 24.41,30.72 25.01,30.72
  Top 0.508: C6.2 25.78,29.46 25.27,29.97 25.27,30.48 | 25.27,30.48 25.37,30.99 | 25.37,30.99 25.01,30.72 25.03,30.72 25.27,30.48 | v45.34,33.53 45.34,35.9 R9.2 44.58,37.68 44.58,43.43 42.99,45.02 U5.S | 25.37,30.99 25.37,33.27 25.53,33.53 | 25.53,33.53 25.53,34.4 R26.2 | 25.53,33.53 v28.7,33.53
  Bottom 0.254: v13.97,31.24 13.97,26.8
  Bottom 0.406: 13.97,26.8 14.1,26.67 14.1,26.6 PANEL.P$1
  Bottom 0.508: v28.7,33.53 v45.34,33.53
  pour Top (isolate 0.305, rank 2, no thermals): 43.31,43.94 arc90 43.81,44.45 43.81,52.7 arc90 43.18,53.34 38.82,53.34 arc90 37.34,51.86 37.34,47.5 arc90 37.97,46.86 39.24,46.86 arc-90 39.88,46.23 39.88,43.94
PANEL_CURRENT  (via drill 0.3 pad 0.1)
  Top 0.254: U3.23 19.76,32.04 v20.15,31.5 | v20.15,29.35 20.25,29.25 22.2,29.25 v22.25,29.05 | v22.25,25.7 24.29,25.7 R23.2
  Top 0.406: R23.2 24.14,25.75 C23.2
  Bottom 0.254: v20.15,31.5 v20.15,29.35 | v22.25,29.05 v22.25,25.7
PANEL_EN  (via drill 0.3 pad 0.64)
  Top 0.203: R22.2 v36.7,37.21 | 13.5,40.51 U3.9 16.35,40.54 16.76,40.13 20.07,40.13 21.72,41.78 v22.73,41.78
  Bottom 0.203: v36.7,37.21 27.3,37.21 v22.73,41.78
PANEL_SWITCH  (1 unrouted)
  Top 0.254: 41.68,31.9 40.77,30.99 27.18,30.99 26.92,30.73 | 26.92,30.73 26.96,30.73 | U4.4 26.91,30.72 26.92,30.73 | 40.86,40.6 40.26,40.01
  Top 0.4: 41.68,33.63 41.68,31.9
  Top 0.406: 41.68,33.63 41.53,33.78 41.53,36.2 41.27,36.45 40.77,36.45 40.39,36.83 40.39,39.88 40.26,40.01
  pour Top (isolate 0.254, no thermals): 32.51,39.24 32.51,42.55 arc-90 33.15,43.18 43.18,43.18 arc-90 43.81,42.55 43.81,39.24 arc-90 43.18,38.61 33.15,38.61 arc-90
PANEL_VOLTAGE
  Top 0.15: 23.87,34.41 23.19,33.58 20.84,33.58 U3.24
  Top 0.203: R27.2 24.02,37.45 C14.2
  Top 0.254: 23.87,34.41 R26.1 R27.2
PWRKEY  (via drill 0.3 pad 0.64)
  Top 0.203: v45.4,30.29 47.43,30.29 47.82,29.91 47.82,28.78 U2.1
  Top 0.254: Q7.3 v23.37,47.12
  Bottom 0.254: v45.4,30.29 46.19,31.07 46.19,33.94 45.71,34.42 27.3,34.42 21.84,39.87 21.84,45.59 v23.37,47.12
RST  (via drill 0.3 pad 0.64)
  Top 0.203: U3.29 21,38.14 18.67,35.81 v18.41,35.81
  Top 0.254: C8.1 5.05,44.45 R3.1 5.07,43.28 AVRISP.5
  Bottom 0.203: AVRISP.5 6.98,41.41 12.19,36.2 15.37,36.2 | 15.37,36.2 15.49,36.2 | 15.49,36.07 15.49,35.56 16.63,34.43 16.63,14.63 RST.P$1 | 15.49,36.07 15.49,36.2 | 15.49,36.2 15.62,36.2 | 15.62,36.2 18.03,36.2 v18.41,35.81 | 15.49,36.07 15.37,36.2 | 15.49,36.07 15.62,36.2
RX  (via drill 0.3 pad 0.64)
  Top 0.203: U3.30 21.04,38.94 18.92,36.83 v18.41,36.83
  Top 0.254: TTL.3 18.78,21.78 v20.34,23.34
  Bottom 0.203: v20.34,23.34 21.14,24.14 21.14,35.38 19.68,36.83 v18.41,36.83 | 19.27,22.27 RX.P$1
  Bottom 0.254: v20.34,23.34 19.27,22.27
SCK
  Top 0.203: U3.17 14.96,33.66 | 14.96,33.66 14.96,33.81 | AVRISP.3 5.71,37.38 5.71,34.92 6.73,33.91 14.7,33.91 14.96,33.66
  Bottom 0.254: SCK.P$1 11.26,24.26 11.26,34.81 AVRISP.3
SIM_CLK
  Top 0.203: U2.32 26.49,10.74 R18.2
SIM_CLK_DIRECT  (via drill 0.3 pad 0.64)
  Top 0.203: SIMHOLDER.3 12.46,4.94 v12.32,5.08 16.93,9.69 R18.1
  Bottom 0.203: v12.32,5.08 11.56,5.08 9.14,7.49 VCC1.P$1
SIM_DATA
  Top 0.203: U2.31 26.03,11.74 R19.1
SIM_DATA_DIRECT  (via drill 0.3 pad 0.64)
  Top 0.203: 23.93,11.18 23.11,11.18 22.86,11.43 22.86,23.09 19.27,26.67 12.83,26.67 12.57,26.92 12.57,28.18 SIMHOLDER.4
  Top 0.254: v9.02,28.19 12.52,28.19 SIMHOLDER.4 | 23.93,11.18 R19.2
  Bottom 0.254: GND11.P$1 9,28.18 v9.02,28.19
SIM_RST
  Top 0.203: U2.33 26.99,9.74 R17.2
SIM_RST_DIRECT  (via drill 0.3 pad 0.64)
  Top 0.203: SIMHOLDER.2 14.91,5.03 v14.86,5.08 17.98,8.2 R17.1
  Bottom 0.203: SCK1.P$1 14,5.94 v14.86,5.08
SIM_VDD  (via drill 0.3 pad 0.64)
  Top 0.406: SIMHOLDER.1 17.51,5.06 v17.53,5.08 19.12,6.67 C20.1 23.88,6.64 v23.88,5.84 | U2.30 24.34,12.74 v24.26,12.83
  Bottom 0.203: RST1.P$1 19.18,7.5
  Bottom 0.406: v17.53,5.08 17.53,6.03 RST1.P$1 | v24.26,12.83 24.26,6.22 v23.88,5.84
STATUS  (via drill 0.3 pad 0.64)
  Top 0.203: R20.2 7.31,45.97 7.75,45.53 7.75,43.94 11.94,39.75 13.46,39.75 U3.10 16.52,39.74 v17.53,38.73 | U2.66 52.97,22.74 53.21,22.99 53.21,26.56 48.84,30.92 v42.04,30.92
  Bottom 0.203: v17.53,38.73 19.56,38.73 26.04,32.26 26.04,29.34 27.3,28.07 39.24,28.07 39.24,28.13 v42.04,30.92
TX  (via drill 0.3 pad 0.64)
  Top 0.203: U3.31 21.07,39.74 18.8,37.47 v17.53,37.47
  Top 0.254: TTL.2 19.62,19.24 v20.43,18.43
  Bottom 0.203: v17.53,37.47 19.68,37.47 21.59,35.56 21.59,34.79 21.6,34.78 21.6,19.6 v20.43,18.43
  Bottom 0.254: v20.43,18.43 TX.P$1
VCC  (via drill 0.3 pad 0.64, 0.38 pad 0.81)
  Top 0.305: U3.6 16.56,43.69 C17.2 v17.4,43.69 | R6.2 56.82,42.91 L1.2 | 18.16,43.69 C18.2 18.16,43.56 U3.4
  Top 0.406: STATUS.+ NETLIGHT.+ POWER.+
  Top 0.508: U3.18 15.76,32.65 | 15.76,32.65 15.37,32.26 | 15.37,32.26 14.35,32.26 13.46,33.15 C7.2 | 15.37,32.26 16.13,32.26 | 16.13,32.26 17.14,32.26 17.36,32.47 U3.20 | 9.91,33.15 9.65,32.89 C2.+ | 15.76,32.65 15.76,32.63 16.13,32.26
  Top 0.61: v8.13,52.96 8.72,52.96 POWER.+ | R3.2 6.59,43.57 v6.6,43.56
  Top 1.016: v17.4,43.69 18.16,43.69 | 5.08,32.89 5.21,32.89 | 5.21,32.89 9.65,32.89 11.56,32.89 | AVRISP.2 4.44,36.33 4.7,36.07 4.7,33.4 | 4.7,33.4 4.7,32.38 | 4.7,32.38 4.7,26.16 TTL.4 | 5.21,32.89 4.7,33.4 | 5.21,32.89 4.7,32.38 | 11.56,32.89 11.56,30.86 12.32,30.1 18.61,30.1 19.11,29.6 19.11,27.81 26.67,27.81 27.94,29.08 v27.94,29.84 | C7.2 11.56,32.89 | C9.2 46.9,33.63 v45.34,32.07
  Bottom 0.406: TTL.4 8.85,18.33 8.85,17.15 VCC.P$1
  Bottom 0.61: AVRISP.2 4.41,36.36 2.41,38.35 2.41,43.05 | 2.41,43.05 2.41,44.07 | 2.41,44.07 2.41,49.28 6.1,52.96 v8.13,52.96 | v6.6,43.56 2.92,43.56 | 2.92,43.56 2.41,44.07 | 2.92,43.56 2.41,43.05
  Bottom 1.016: 27.94,32.51 27.94,31.5 | 27.94,31.5 v27.94,29.84 | 27.94,32.51 17.4,43.05 v17.4,43.69 | v45.34,32.07 28.51,32.07 | 28.51,32.07 28.38,32.07 27.94,32.51 | 28.51,32.07 27.94,31.5
  Bottom 2.032: v55.75,13.08 50.67,13.08 49.41,14.34 49.41,21.47 53.85,25.91 v53.85,35.18
  other vias: 54.86,13.59 54.86,12.57 53.21,34.54 54.48,34.54
  pour Top (isolate 0.254, no thermals): 50.94,14.03 57.34,14.03 arc-90 57.53,13.84 57.53,11.61 arc-90 57.35,11.43 50.98,11.43 arc-90 50.8,11.61 50.8,13.89 arc-90
  pour Top (isolate 0.254, no thermals): 52.7,35.56 52.7,33.66 arc90 53.09,33.27 57.66,33.27 arc90 58.04,33.66 58.04,43.94 arc90 57.66,44.32 55.5,44.32 arc90 55.12,43.94 55.12,36.32 arc-90 54.74,35.94 53.09,35.94 arc90
VDD  (via drill 0.3)
  Top 0.152: v45.6,51.3 46.1,51.18
  Top 0.254: R4.2 49.93,50.06 49.53,49.66 U1.2
  Top 0.61: U1.2 46.25,49.66 C24.2
  Top 1.016: R4.2 47.3,52.76 arc45 C11.2 | C24.2 46.1,51.18 47.12,52.2 47.12,54.48 47.88,55.24 47.88,55.82 D2.C
VRTC
  Top 0.508: U2.26 24.61,16.74 24.51,16.64 C15.+

### Text on the board
tPlace: - | + | PANEL- | SIMHOLDER | v2.8 march 2014
tNames: LIGHT | NET